# EAGLE board actuator_control_board_1.0.0 (EAGLE 6.6.0), part 1 of 2
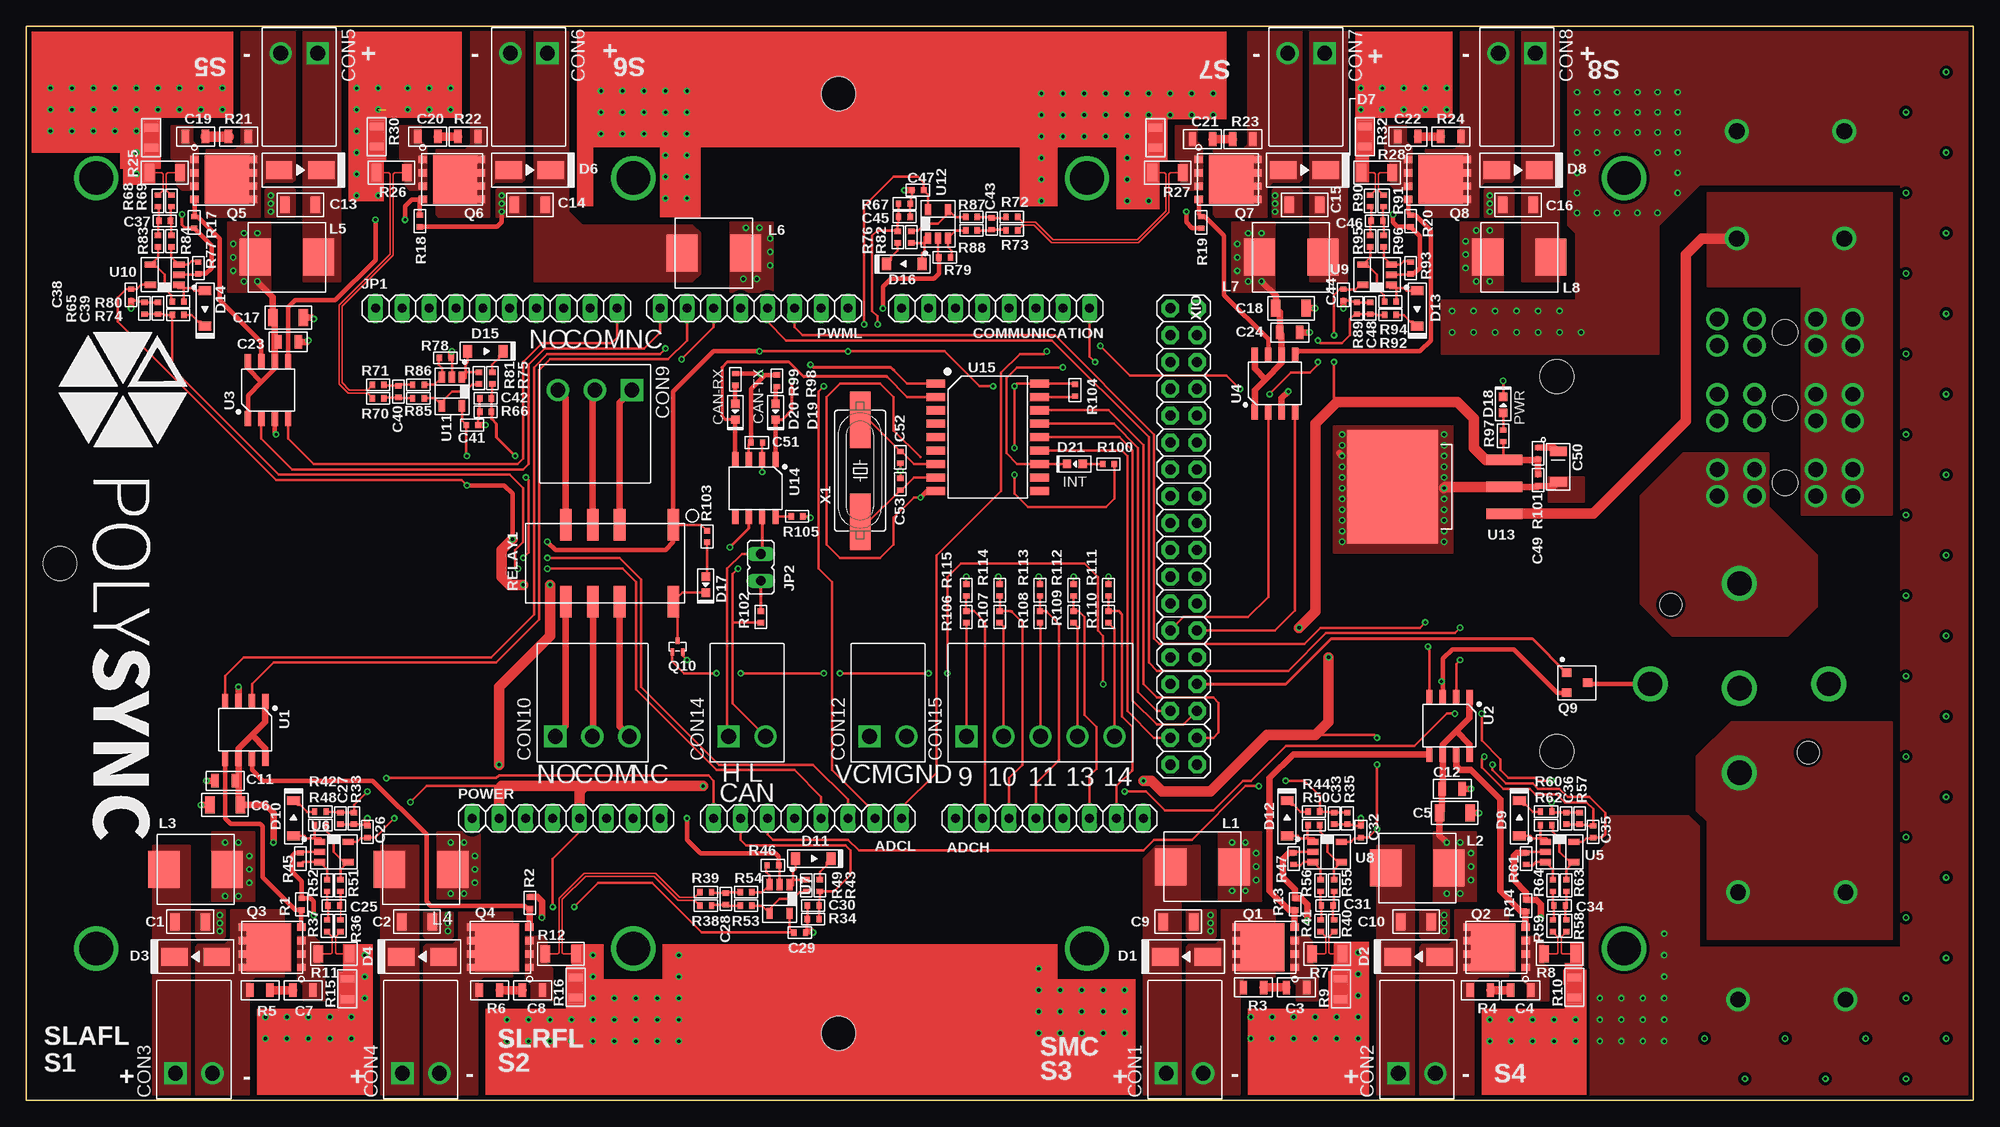
[diagram p5: board, top side]
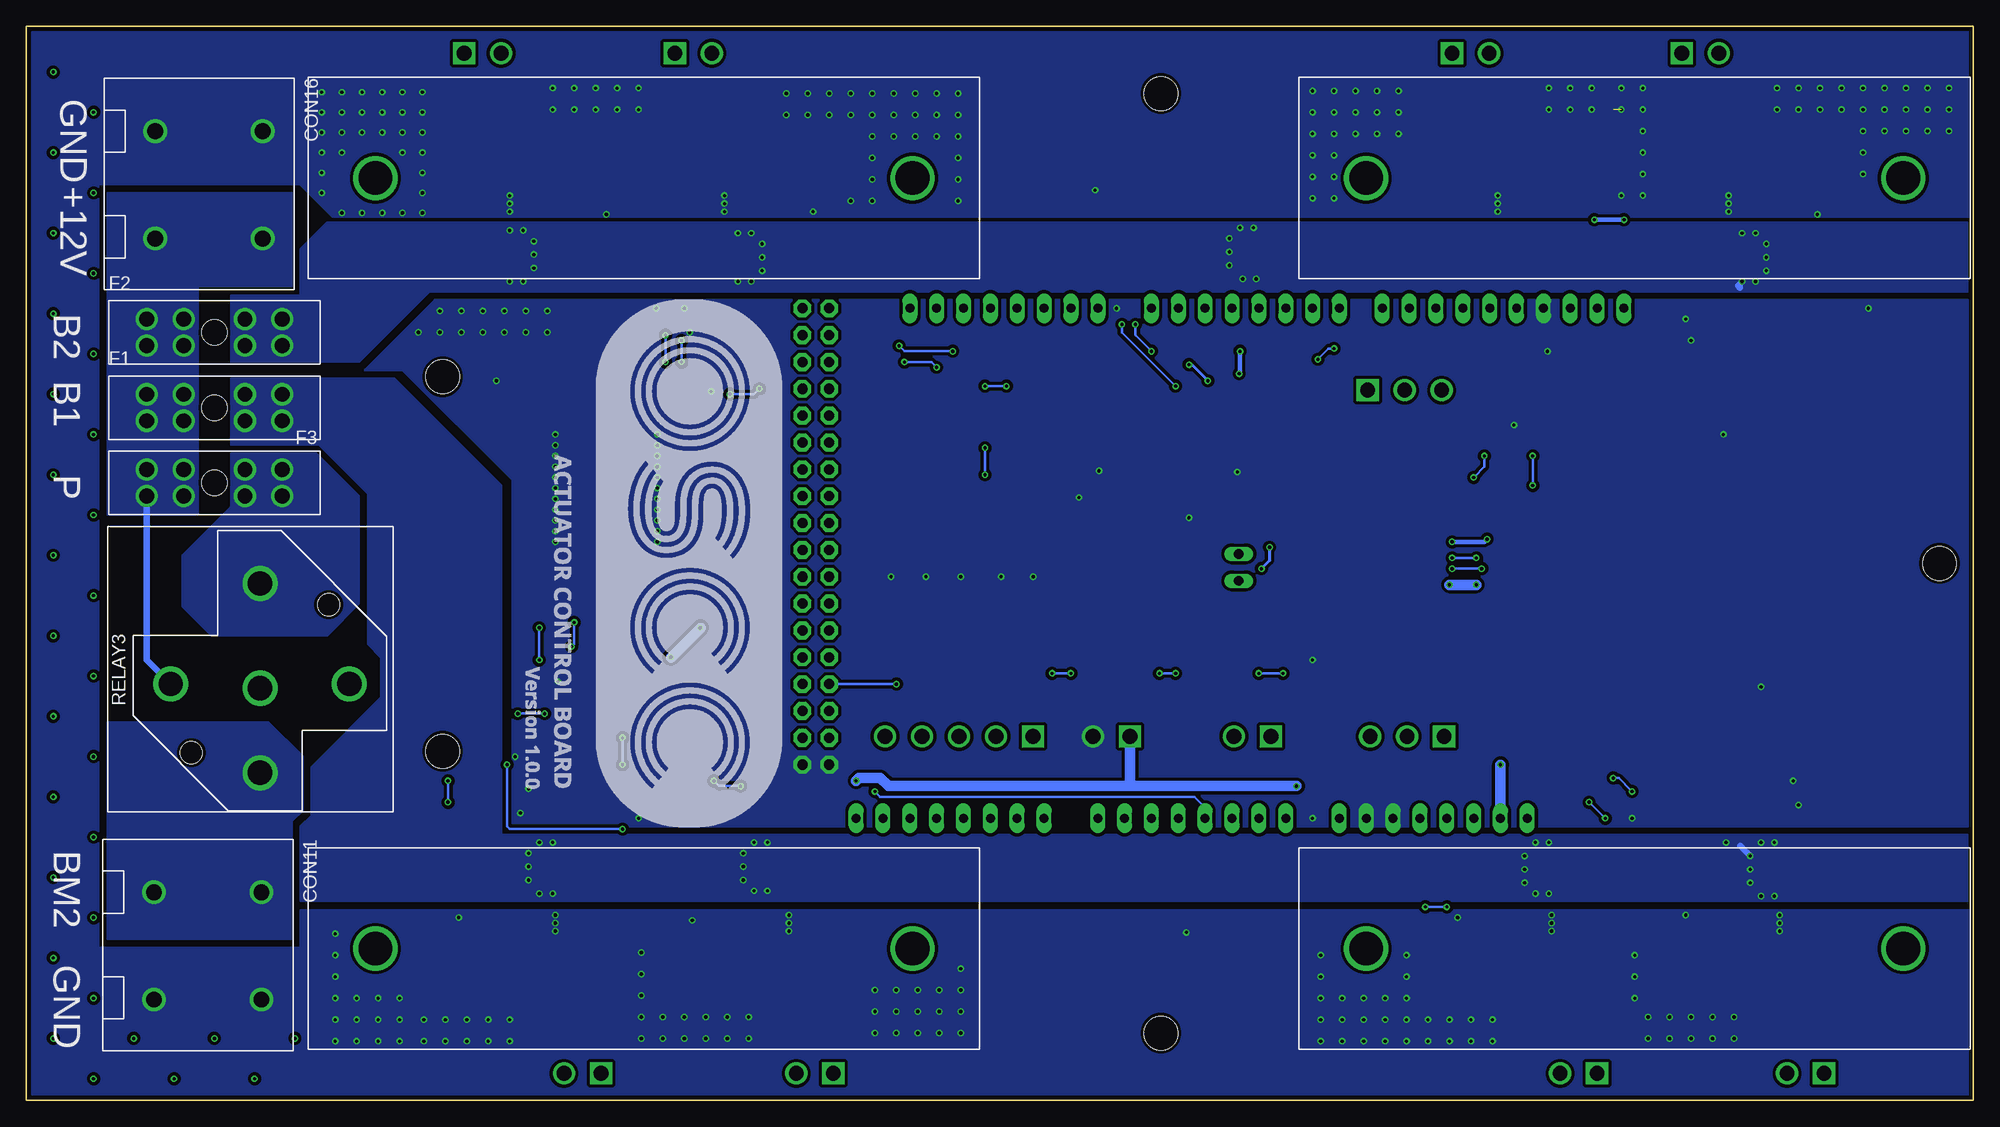
[diagram p6: board, bottom side, seen from below]

Size 184.15 x 101.6 mm. Coordinates in mm from the lower left corner, seen from the top.
Outline: 0,0 0,101.6 184.15,101.6 184.15,0 0,0
Copper layers (1*16): Top 0.035mm / dielectric 1.5mm / Bottom 0.035mm
Design rules "MF_Standard_2_Layer": minimum track width 6mil, minimum drill 12mil, track to track 6mil, track to pad 6mil, pad to pad 6mil, via to via 6mil, smd to smd 0mil, copper to edge 10mil, drill to drill 10mil, minimum pad ring 6mil, minimum via ring 6mil, stop-mask expansion 2mil, vias tented up to drill 25mil, thermal gap 10mil
Net classes: 0 default: width 0.152 mm, drill 0.305 mm, clearance 0.152 mm; 1 power: width 0.61 mm, drill 0.406 mm, clearance 0.203 mm; 2 gnd: width 0.305 mm, drill 0.406 mm, clearance 0.203 mm; 3 power usb: width 0.508 mm, drill 0.406 mm, clearance 0.203 mm
Holes 3.2 mm at 144.78,68.45 76.83,95.25 76.83,6.35 3.17,50.8 144.78,33.02

## Footprints (pad centres in the part's own frame; a part is rotated, then mirrored left to right if it is on the bottom)
1X08 = drill 0.85 pad 1.422 long: 1 -8.89,0; 2 -6.35,0; 3 -3.81,0; 4 -1.27,0; 5 1.27,0; 6 3.81,0; 7 6.35,0; 8 8.89,0
C1206 = smd 0.9 x 1.6: P$1 -1.45,0; P$2 1.45,0
C0805 = smd 0.7 x 1.3: P$1 -0.95,0; P$2 0.95,0
C0402 = smd 0.5 x 0.6: P$1 -0.55,0; P$2 0.55,0
CP1206 = smd 0.9 x 1.6: P$1 -1.45,0; P$2 1.45,0
PHOENIX_2_45 = drill 1.4 square: P$1 0,0 | drill 1.4: P$2 3.5,0
PHOENIX_3_45 = drill 1.4 square: P$1 0,0 | drill 1.4: P$2 3.5,0; P$3 7,0
PHOENIX_2_10.16MM = drill 1.5: P$1 0,0; P$2 0,-10.16; P$3 10.16,0; P$4 10.16,-10.16
PHOENIX_5_45 = drill 1.4 square: P$1 1.3,1.27 | drill 1.4: P$2 4.8,1.27; P$3 8.3,1.27; P$4 11.8,1.27; P$5 15.3,1.27
SMA = smd 2.5 x 1.7: ANODE 2,0; CATHODE -2,0
SOD-123 = smd 0.85 x 1.2: ANODE 1.675,0; CATHODE -1.675,0
LED0603 = smd 0.8 x 0.8: ANODE 0.75,0; CATHODE -0.75,0
FUSE_ATO = drill 1.4: P$1 -6.4,1.25; P$2 -2.9,1.25; P$3 -6.4,-1.25; P$4 -2.9,-1.25; P$5 2.9,1.25; P$6 6.4,1.25; P$7 2.9,-1.25; P$8 6.4,-1.25 | hole 2.4: 0,0
1X10 = drill 0.85 pad 1.422 long: 1 -11.43,0; 2 -8.89,0; 3 -6.35,0; 4 -3.81,0; 5 -1.27,0; 6 1.27,0; 7 3.81,0; 8 6.35,0; 9 8.89,0; 10 11.43,0
JP1 = drill 0.914 long: 1 0,-1.27; 2 0,1.27
SRP7050 = smd 2.95 x 3.5: P$1 -3,0; P$2 3,0
SON8-DQJ = smd 0.8 x 0.7: P$1 -2.752,1.905; P$2 -2.752,0.635; P$3 -2.752,-0.635; P$4 -2.752,-1.905; P$5 2.752,-1.905; P$6 2.752,-0.635; P$7 2.752,0.635; P$8 2.752,1.905 | smd 4.2 x 4.56: P$9 0.3,0
SOT-23-3 = smd 0.9 x 0.8: P$1 -1,0.95; P$2 -1,-0.95; P$3 1,0
EMT3F = smd 0.46 x 0.65: P$1 -0.5,0; P$2 0.5,0; P$3 0,1.05
R0402 = smd 0.5 x 0.6: P$1 -0.55,0; P$2 0.55,0
R0805 = smd 0.7 x 1.3: P$1 -0.95,0; P$2 0.95,0
R1206 = smd 0.9 x 1.6: P$1 -1.45,0; P$2 1.45,0
KEMET_EE2 = smd 1.1 x 3: P$1 -6.45,-3.645; P$3 -1.37,-3.645; P$4 1.17,-3.645; P$5 3.71,-3.645; P$8 3.71,3.645; P$9 1.17,3.645; P$10 -1.37,3.645; P$12 -6.45,3.645
VCF4-SOCKET = drill 2.3: 30 17.9,0; 85 8.4,-8.45; 86 8.4,8.45; 87 0,0; 87A 8,0 | hole 2.1: 1.9,6.5; 15.9,-6.5
TP_4545 = smd 1.143 x 1.143: T 0,0
SOIC-8 = smd 0.6 x 1.4: 1 -1.905,-2.7; 2 -0.635,-2.7; 3 0.635,-2.7; 4 1.905,-2.7; 5 1.905,2.7; 6 0.635,2.7; 7 -0.635,2.7; 8 -1.905,2.7
SOT-23-5 = smd 1.05 x 0.6: P$1 -1.35,0.95; P$2 -1.35,0; P$3 -1.35,-0.95; P$4 1.35,-0.95; P$5 1.35,0.95
TO-263 = smd 1 x 3.4: P$1 -2.54,0; P$2 0,0; P$3 2.54,0 | smd 10.7 x 8.6: P$4 0,10.6
SOIC8-6.0 = smd 0.6 x 1.4: 1 -1.905,-2.7; 2 -0.635,-2.7; 3 0.635,-2.7; 4 1.905,-2.7; 5 1.905,2.7; 6 0.635,2.7; 7 -0.635,2.7; 8 -1.905,2.7
SOIC18 = smd 0.762 x 1.778: 1 -5.08,-4.915; 2 -3.81,-4.915; 3 -2.54,-4.915; 4 -1.27,-4.915; 5 0,-4.915; 6 1.27,-4.915; 7 2.54,-4.915; 8 3.81,-4.915; 9 5.08,-4.915; 10 5.08,4.915; 11 3.81,4.915; 12 2.54,4.915; 13 1.27,4.915; 14 0,4.915; 15 -1.27,4.915; 16 -2.54,4.915; 17 -3.81,4.915; 18 -5.08,4.915
HEATSINK_2X_75 = drill 3.175: P$1 6.35,9.525; P$2 57.15,9.525
HC49UP = smd 5.334 x 1.93: 1 -4.826,0; 2 4.826,0
2X18 = drill 0.95 pad 1.676 octagon: 1 -21.59,-1.27; 2 -21.59,1.27; 3 -19.05,-1.27; 4 -19.05,1.27; 5 -16.51,-1.27; 6 -16.51,1.27; 7 -13.97,-1.27; 8 -13.97,1.27; 9 -11.43,-1.27; 10 -11.43,1.27; 11 -8.89,-1.27; 12 -8.89,1.27; 13 -6.35,-1.27; 14 -6.35,1.27; 15 -3.81,-1.27; 16 -3.81,1.27; 17 -1.27,-1.27; 18 -1.27,1.27; 19 1.27,-1.27; 20 1.27,1.27; 21 3.81,-1.27; 22 3.81,1.27; 23 6.35,-1.27; 24 6.35,1.27; 25 8.89,-1.27; 26 8.89,1.27; 27 11.43,-1.27; 28 11.43,1.27; 29 13.97,-1.27; 30 13.97,1.27; 31 16.51,-1.27; 32 16.51,1.27; 33 19.05,-1.27; 34 19.05,1.27; 35 21.59,-1.27; 36 21.59,1.27

## Placement (x,y rotation side)
ADCH  8x1F-H8.5  [1X08]  96.77,26.67 0 top
ADCL  8x1F-H8.5  [1X08]  73.91,26.67 0 top
C1  1u  [C1206]  15.49,16.89 0 top
C2  1u  [C1206]  36.96,16.89 0 top
C3  0.1u  [C0805]  120.14,10.67 0 top
C4  0.1u  [C0805]  141.35,10.41 0 top
C5  1u  [C1206]  135.13,27.18 0 top
C6  1u  [C1206]  18.8,27.94 180 top
C7  0.1u  [C0805]  26.16,10.41 0 top
C8  0.1u  [C0805]  47.88,10.41 0 top
C9  1u  [C1206]  108.97,16.89 0 top
C10  1u  [C1206]  131.44,16.89 0 top
C11  0.1u  [C0805]  18.8,30.23 180 top
C12  0.1u  [C0805]  134.87,29.46 0 top
C13  1u  [C1206]  25.91,84.71 180 top
C14  1u  [C1206]  47.62,84.71 180 top
C15  1u  [C1206]  120.9,84.71 180 top
C16  1u  [C1206]  141.1,84.71 180 top
C17  1u  [C1206]  24.77,74.04 0 top
C18  1u  [C1206]  119.63,74.93 0 top
C19  0.1u  [C0805]  16,91.19 180 top
C20  0.1u  [C0805]  37.97,91.19 180 top
C21  0.1u  [C0805]  111.25,90.93 180 top
C22  0.1u  [C0805]  130.68,91.19 180 top
C23  0.1u  [C0805]  24.77,71.75 0 top
C24  0.1u  [C0805]  119.51,72.64 0 top
C25  100p  [C0402]  29.08,18.41 180 top
C26  .1u  [C0402]  32.26,25.4 90 top
C27  .1u  [C0402]  29.72,26.67 270 top
C28  100p  [C0402]  66.17,19.05 90 top
C29  .1u  [C0402]  73.15,15.88 0 top
C30  .1u  [C0402]  74.42,18.41 180 top
C31  100p  [C0402]  123.06,18.41 180 top
C32  .1u  [C0402]  126.24,25.4 90 top
C33  .1u  [C0402]  123.7,26.67 270 top
C34  100p  [C0402]  145.03,18.41 180 top
C35  .1u  [C0402]  148.21,25.4 90 top
C36  .1u  [C0402]  145.67,26.67 270 top
C37  100p  [C0402]  13.08,83.19 0 top
C38  .1u  [C0402]  9.91,76.2 270 top
C39  .1u  [C0402]  12.45,74.93 90 top
C40  100p  [C0402]  35.18,67.06 90 top
C41  .1u  [C0402]  42.16,63.88 0 top
C42  .1u  [C0402]  43.43,66.42 180 top
C43  100p  [C0402]  91.31,82.93 270 top
C44  .1u  [C0402]  124.59,76.2 270 top
C45  .1u  [C0402]  83.06,83.57 0 top
C46  100p  [C0402]  127.76,83.19 0 top
C47  .1u  [C0402]  84.33,86.11 180 top
C48  .1u  [C0402]  127.13,74.93 90 top
C49  .1u  [C0402]  143,58.67 270 top
C50  33u  [CP1206]  144.91,59.94 270 top
C51  .1u  [C0402]  69.09,62.23 0 top
C52  22p  [C0402]  82.68,60.83 90 top
C53  22p  [C0402]  82.68,58.29 270 top
COMMUNICATION  8x1F-H8.5  [1X08]  91.69,74.93 180 top
CON1  CON23.5MM  [PHOENIX_2_45]  107.82,2.54 0 top
CON2  CON23.5MM  [PHOENIX_2_45]  129.79,2.54 0 top
CON3  CON23.5MM  [PHOENIX_2_45]  14.1,2.54 0 top
CON4  CON23.5MM  [PHOENIX_2_45]  35.56,2.54 0 top
CON5  CON23.5MM  [PHOENIX_2_45]  27.56,99.06 180 top
CON6  CON23.5MM  [PHOENIX_2_45]  49.28,99.06 180 top
CON7  CON23.5MM  [PHOENIX_2_45]  122.81,99.06 180 top
CON8  CON23.5MM  [PHOENIX_2_45]  142.75,99.06 180 top
CON9  CON3  [PHOENIX_3_45]  57.28,67.18 180 top
CON10  CON3  [PHOENIX_3_45]  50.04,34.42 0 top
CON11  CON210.16MM  [PHOENIX_2_10.16MM]  161.93,19.68 270 bottom
CON12  CON23.5MM  [PHOENIX_2_45]  79.76,34.42 0 top
CON14  CON23.5MM  [PHOENIX_2_45]  66.42,34.42 0 top
CON15  CON5  [PHOENIX_5_45]  87.63,33.15 0 top
CON16  CON210.16MM  [PHOENIX_2_10.16MM]  161.8,91.69 270 bottom
D1  DIODES_SMA  [SMA]  109.73,13.59 0 top
D2  DIODES_SMA  [SMA]  131.7,13.59 0 top
D3  DIODES_SMA  [SMA]  16,13.59 0 top
D4  DIODES_SMA  [SMA]  37.47,13.59 0 top
D5  DIODES_SMA  [SMA]  25.91,88.01 180 top
D6  DIODES_SMA  [SMA]  47.62,88.01 180 top
D7  DIODES_SMA  [SMA]  120.9,88.01 180 top
D8  DIODES_SMA  [SMA]  141.1,88.01 180 top
D9  DIODES_SOD-123  [SOD-123]  141.22,26.67 270 top
D10  DIODES_SOD-123  [SOD-123]  25.27,26.67 270 top
D11  DIODES_SOD-123  [SOD-123]  74.42,22.86 180 top
D12  DIODES_SOD-123  [SOD-123]  119.25,26.67 270 top
D13  DIODES_SOD-123  [SOD-123]  131.57,74.93 90 top
D14  DIODES_SOD-123  [SOD-123]  16.89,74.93 90 top
D15  DIODES_SOD-123  [SOD-123]  43.43,70.87 180 top
D16  DIODES_SOD-123  [SOD-123]  83.06,79.12 0 top
D17  [LED0603]  64.26,48.77 90 top
D18  Green  [LED0603]  139.7,65.79 270 top
D19  Green  [LED0603]  70.87,65.15 90 top
D20  Red  [LED0603]  67.06,65.15 90 top
D21  Blue  [LED0603]  99.19,60.2 0 top
F1  20A  [FUSE_ATO]  166.37,65.53 0 bottom
F2  20A  [FUSE_ATO]  166.37,72.64 0 bottom
F3  40A  [FUSE_ATO]  166.37,58.42 180 bottom
JP1  10x1F-H8.5  [1X10]  44.45,74.93 0 top
JP2  [JP1]  69.47,50.42 180 top
L1  2.2u  [SRP7050]  111.25,22.1 180 top
L2  2.2u  [SRP7050]  131.57,21.97 180 top
L3  2.2u  [SRP7050]  16,21.84 180 top
L4  2.2u  [SRP7050]  37.34,21.84 180 top
L5  2.2u  [SRP7050]  24.64,79.76 0 top
L6  2.2u  [SRP7050]  65.02,80.14 180 top
L7  2.2u  [SRP7050]  119.63,79.76 0 top
L8  2.2u  [SRP7050]  141.22,79.76 0 top
POWER  8x1F-H8.5  [1X08]  51.05,26.67 0 top
PWML  8x1F-H8.5  [1X08]  68.83,74.93 180 top
Q1  N-FET-TO263NEXFET  [SON8-DQJ]  117.22,14.48 180 top
Q2  N-FET-TO263NEXFET  [SON8-DQJ]  139.06,14.48 180 top
Q3  N-FET-TO263NEXFET  [SON8-DQJ]  23.24,14.48 180 top
Q4  N-FET-TO263NEXFET  [SON8-DQJ]  44.83,14.48 180 top
Q5  N-FET-TO263NEXFET  [SON8-DQJ]  18.67,87.12 0 top
Q6  N-FET-TO263NEXFET  [SON8-DQJ]  40.26,87.12 0 top
Q7  N-FET-TO263NEXFET  [SON8-DQJ]  113.67,87.12 0 top
Q8  N-FET-TO263NEXFET  [SON8-DQJ]  133.48,87.12 0 top
Q9  [SOT-23-3]  146.69,39.5 0 top
Q10  RE1C002UN  [EMT3F]  61.59,42.42 0 top
R1  10k  [R0402]  26.04,18.54 90 top
R2  10k  [R0402]  47.62,18.67 90 top
R3  100  [R0805]  116.08,10.67 0 top
R4  100  [R0805]  137.54,10.41 0 top
R5  100  [R0805]  22.1,10.41 0 top
R6  100  [R0805]  43.81,10.41 0 top
R7  .02  [R1206]  123.06,13.84 0 top
R8  .02  [R1206]  145.03,13.84 0 top
R9  0  [R0805]  124.33,10.54 90 top
R10  0  [R0805]  146.43,10.67 90 top
R11  .02  [R1206]  29.08,13.84 0 top
R12  .02  [R1206]  50.55,13.84 0 top
R13  10k  [R0402]  120.02,18.54 90 top
R14  10k  [R0402]  141.86,18.41 90 top
R15  0  [R0805]  30.35,10.54 90 top
R16  0  [R0805]  51.94,10.67 90 top
R17  10k  [R0402]  15.88,83.06 270 top
R18  10k  [R0402]  37.21,83.19 270 top
R19  10k  [R0402]  111.12,83.06 270 top
R20  10k  [R0402]  130.94,83.19 270 top
R21  100  [R0805]  20.07,91.19 180 top
R22  100  [R0805]  41.78,91.19 180 top
R23  100  [R0805]  115.06,90.93 180 top
R24  100  [R0805]  134.75,91.19 180 top
R25  .02  [R1206]  13.08,87.76 180 top
R26  .02  [R1206]  34.54,87.76 180 top
R27  .02  [R1206]  107.95,87.76 180 top
R28  .02  [R1206]  127.76,87.76 180 top
R29  0  [R0805]  11.81,91.06 270 top
R30  0  [R0805]  33.15,91.19 270 top
R31  0  [R0805]  106.81,91.06 270 top
R32  0  [R0805]  126.62,91.19 270 top
R33  100k  [R0402]  30.99,26.67 90 top
R34  100k  [R0402]  74.42,17.14 0 top
R35  100k  [R0402]  124.97,26.67 90 top
R36  1k  [R0402]  29.72,16.51 90 top
R37  1k  [R0402]  28.45,16.51 90 top
R38  1k  [R0402]  64.26,18.41 0 top
R39  1k  [R0402]  64.26,19.68 0 top
R40  1k  [R0402]  123.7,16.51 90 top
R41  1k  [R0402]  122.43,16.51 90 top
R42  1k  [R0402]  27.81,27.3 0 top
R43  1k  [R0402]  75.06,20.32 270 top
R44  1k  [R0402]  121.79,27.3 0 top
R45  100k  [R0402]  25.91,22.86 270 top
R46  100k  [R0402]  70.61,22.23 180 top
R47  100k  [R0402]  119.89,22.86 270 top
R48  100k  [R0402]  27.81,26.04 0 top
R49  100k  [R0402]  73.79,20.32 270 top
R50  100k  [R0402]  121.79,26.04 0 top
R51  1k  [R0402]  29.72,20.32 90 top
R52  1k  [R0402]  28.45,20.32 90 top
R53  1k  [R0402]  68.07,18.41 0 top
R54  1k  [R0402]  68.07,19.68 0 top
R55  1k  [R0402]  123.7,20.32 90 top
R56  1k  [R0402]  122.43,20.32 90 top
R57  100k  [R0402]  146.94,26.67 90 top
R58  1k  [R0402]  145.67,16.51 90 top
R59  1k  [R0402]  144.4,16.51 90 top
R60  1k  [R0402]  143.76,27.3 0 top
R61  100k  [R0402]  141.86,22.86 270 top
R62  100k  [R0402]  143.76,26.04 0 top
R63  1k  [R0402]  145.67,20.32 90 top
R64  1k  [R0402]  144.4,20.32 90 top
R65  100k  [R0402]  11.18,74.93 270 top
R66  100k  [R0402]  43.43,65.15 0 top
R67  100k  [R0402]  83.06,84.84 180 top
R68  1k  [R0402]  12.45,85.09 270 top
R69  1k  [R0402]  13.72,85.09 270 top
R70  1k  [R0402]  33.27,66.42 0 top
R71  1k  [R0402]  33.27,67.69 0 top
R72  1k  [R0402]  93.22,83.57 180 top
R73  1k  [R0402]  93.22,82.3 180 top
R74  1k  [R0402]  14.35,74.3 180 top
R75  1k  [R0402]  44.07,68.33 270 top
R76  1k  [R0402]  82.42,81.66 90 top
R77  100k  [R0402]  16.26,78.74 90 top
R78  100k  [R0402]  39.62,70.23 180 top
R79  100k  [R0402]  86.87,79.76 0 top
R80  100k  [R0402]  14.35,75.56 180 top
R81  100k  [R0402]  42.8,68.33 270 top
R82  100k  [R0402]  83.69,81.66 90 top
R83  1k  [R0402]  12.45,81.28 270 top
R84  1k  [R0402]  13.72,81.28 270 top
R85  1k  [R0402]  37.08,66.42 0 top
R86  1k  [R0402]  37.08,67.69 0 top
R87  1k  [R0402]  89.41,83.57 180 top
R88  1k  [R0402]  89.41,82.3 180 top
R89  100k  [R0402]  125.86,74.93 270 top
R90  1k  [R0402]  127.13,85.09 270 top
R91  1k  [R0402]  128.4,85.09 270 top
R92  1k  [R0402]  129.03,74.3 180 top
R93  100k  [R0402]  130.94,78.74 90 top
R94  100k  [R0402]  129.03,75.56 180 top
R95  1k  [R0402]  127.13,81.28 270 top
R96  1k  [R0402]  128.4,81.28 270 top
R97  1k  [R0402]  139.7,62.87 270 top
R98  1k  [R0402]  70.99,68.07 90 top
R99  1k  [R0402]  67.06,68.2 90 top
R100  1k  [R0402]  102.36,60.2 0 top
R101  .3  [R0402]  143,61.21 90 top
R102  120  [R0402]  69.47,45.72 90 top
R103  1k  [R0402]  64.39,53.34 90 top
R104  10k  [R0402]  99.19,67.18 270 top
R105  47k  [R0402]  72.9,55.24 0 top
R106  0  [R0402]  88.9,45.72 270 top
R107  0  [R0402]  92.08,45.72 270 top
R108  0  [R0402]  95.89,45.72 270 top
R109  0  [R0402]  99.06,45.72 270 top
R110  0  [R0402]  102.36,45.72 270 top
R111  DNP  [R0402]  102.36,48.26 90 top
R112  DNP  [R0402]  99.06,48.26 90 top
R113  DNP  [R0402]  95.89,48.26 90 top
R114  DNP  [R0402]  92.08,48.26 90 top
R115  DNP  [R0402]  88.9,48.26 90 top
RELAY1  RELAY_DPDT  [KEMET_EE2]  54.74,50.8 180 top
RELAY2  RELAY_BOM  [VCF4_RELAY]  162.94,40.77 0 bottom
RELAY3  RELAY_VF4  [VCF4-SOCKET]  162.05,30.99 90 bottom
TP1  [TP_4545]  -57.28,52.45 0 bottom  (outside the outline)
TP2  [TP_4545]  -56.01,45.97 0 bottom  (outside the outline)
TP3  [TP_4545]  -62.36,50.29 0 bottom  (outside the outline)
U1  UCC27524  [SOIC-8]  20.7,35.05 180 top
U2  UCC27524  [SOIC-8]  134.62,35.43 180 top
U3  UCC27524  [SOIC-8]  22.86,67.18 0 top
U4  UCC27524  [SOIC-8]  118.11,67.82 0 top
U5  OPA170  [SOT-23-5]  145.03,23.5 0 top
U6  OPA170  [SOT-23-5]  29.08,23.5 0 top
U7  OPA170  [SOT-23-5]  71.25,19.05 270 top
U8  OPA170  [SOT-23-5]  123.06,23.5 0 top
U9  OPA170  [SOT-23-5]  127.76,78.11 180 top
U10  OPA170  [SOT-23-5]  13.08,78.11 180 top
U11  OPA170  [SOT-23-5]  40.26,67.06 270 top
U12  OPA170  [SOT-23-5]  86.23,82.93 90 top
U13  TL750M  [TO-263]  139.83,58.04 90 top
U14  MCP2551  [SOIC8-6.0]  68.96,57.91 180 top
U15  MCP2515  [SOIC18]  90.93,62.74 270 top
U$3  [HEATSINK_2X_75]  63.75,4.83 0 bottom
U$7  [HEATSINK_2X_75]  157.48,4.83 0 bottom
U$9  [HEATSINK_2X_75]  0.25,96.77 180 bottom
U$10  [HEATSINK_2X_75]  93.98,96.77 180 bottom
U$11  [OSCC_LOGO]  140.46,76.2 270 bottom
U$13  [POLYSYNC]  3.05,72.64 270 top
X1  16MHz  [HC49UP]  78.87,59.56 90 top
XIO  18x2F-H8.5  [2X18]  109.47,53.34 270 top